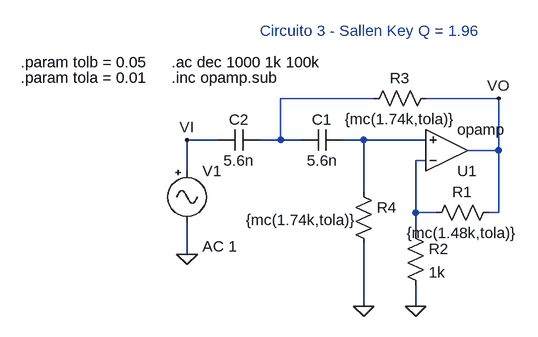
[diagram p0: schematic Circuito3.asc]
Circuito3.asc, the LTspice schematic file:
Version 4
SHEET 1 880 680
WIRE 112 80 -32 80
WIRE 304 80 192 80
WIRE -128 144 -176 144
WIRE -32 144 -32 80
WIRE -32 144 -64 144
WIRE 0 144 -32 144
WIRE 96 144 64 144
WIRE 192 144 96 144
WIRE 304 160 304 80
WIRE 304 160 256 160
WIRE 192 176 176 176
WIRE -176 192 -176 144
WIRE 96 224 96 144
WIRE 176 256 176 176
WIRE 208 256 176 256
WIRE 304 256 304 160
WIRE 304 256 288 256
WIRE 176 288 176 256
WIRE -176 320 -176 272
WIRE 96 400 96 304
WIRE 176 400 176 368
FLAG 176 400 0
FLAG 96 400 0
FLAG 304 80 VO
FLAG -176 320 0
FLAG -176 144 VI
SYMBOL Opamps\\opamp 224 224 M180
SYMATTR InstName U1
SYMBOL cap 64 128 R90
WINDOW 0 0 32 VBottom 2
WINDOW 3 32 32 VTop 2
SYMATTR InstName C1
SYMATTR Value 5.6n
SYMBOL cap -64 128 R90
WINDOW 0 0 32 VBottom 2
WINDOW 3 32 32 VTop 2
SYMATTR InstName C2
SYMATTR Value 5.6n
SYMBOL res 304 240 R90
WINDOW 0 0 56 VBottom 2
WINDOW 3 32 56 VTop 2
SYMATTR InstName R1
SYMATTR Value {mc(1.48k,tola)}
SYMBOL res 160 272 R0
SYMATTR InstName R2
SYMATTR Value 1k
SYMBOL res 208 64 R90
WINDOW 0 0 56 VBottom 2
WINDOW 3 32 56 VTop 2
SYMATTR InstName R3
SYMATTR Value {mc(1.74k,tola)}
SYMBOL res 80 208 R0
WINDOW 3 -165 59 Left 2
SYMATTR Value {mc(1.74k,tola)}
SYMATTR InstName R4
SYMBOL Misc\\signal -176 176 R0
WINDOW 123 24 132 Left 2
WINDOW 39 0 0 Left 2
SYMATTR Value2 AC 1
SYMATTR InstName V1
SYMATTR Value ""
TEXT -200 48 Left 2 !.inc opamp.sub
TEXT -200 24 Left 2 !.ac dec 1000 1k 100k
TEXT -64 -24 Left 2 ;Circuito 3 - Sallen Key Q = 1.96
TEXT -432 24 Left 2 !.param tolb = 0.05
TEXT -432 48 Left 2 !.param tola = 0.01

The netlist it stands for:
* Circuito3.asc
XU1 N003 N002 VO opamp Aol=100K GBW=10Meg  ; pins invin noninvin out
C1 N002 N001 5.6n
C2 N001 VI 5.6n
R1 VO N003 {mc(1.48k,tola)}
R2 N003 0 1k
R3 VO N001 {mc(1.74k,tola)}
R4 N002 0 {mc(1.74k,tola)}
V1 VI 0 AC 1
.inc opamp.sub
.ac dec 1000 1k 100k
* Circuito 3 - Sallen Key Q = 1.96
.param tolb = 0.05
.param tola = 0.01
.backanno
.end